# EAGLE design PoppingElement (EAGLE 6.5.0)
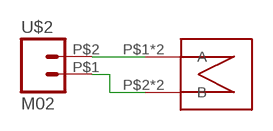
[diagram p0: schematic, sheet 1]

## Parts
U$1  CIGARETTE_LIGHTER  [CIGARETTE_LIGHTER]
U$2  M02  [PADS_2MMX2]

## Nets
N$1: U$1.P$1(A) U$1.P$3(A) U$2.P$2
N$2: U$1.P$2(B) U$1.P$4(B) U$2.P$1

## Library data of the parts
U$1 = blinkinlabs:CIGARETTE_LIGHTER
U$2 = blinkinlabs:M02

## Board
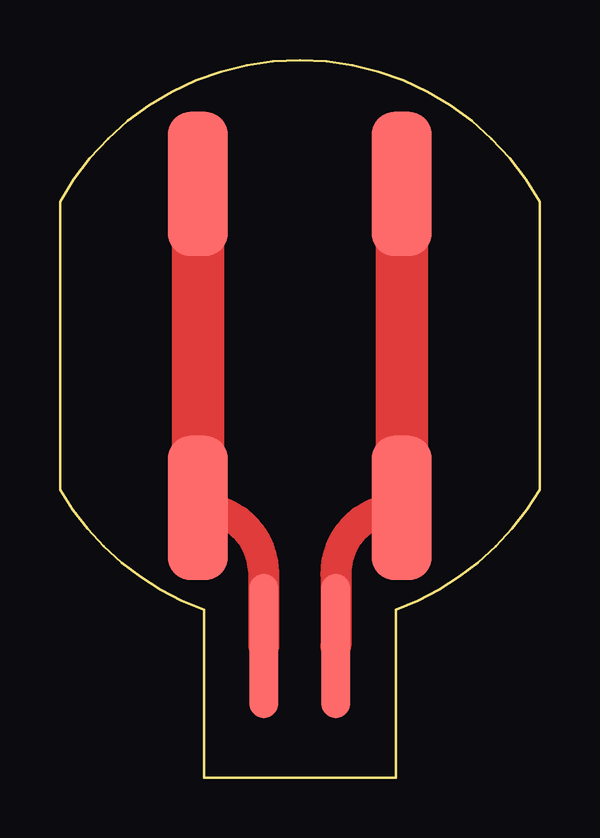
[diagram p1: board, top side]
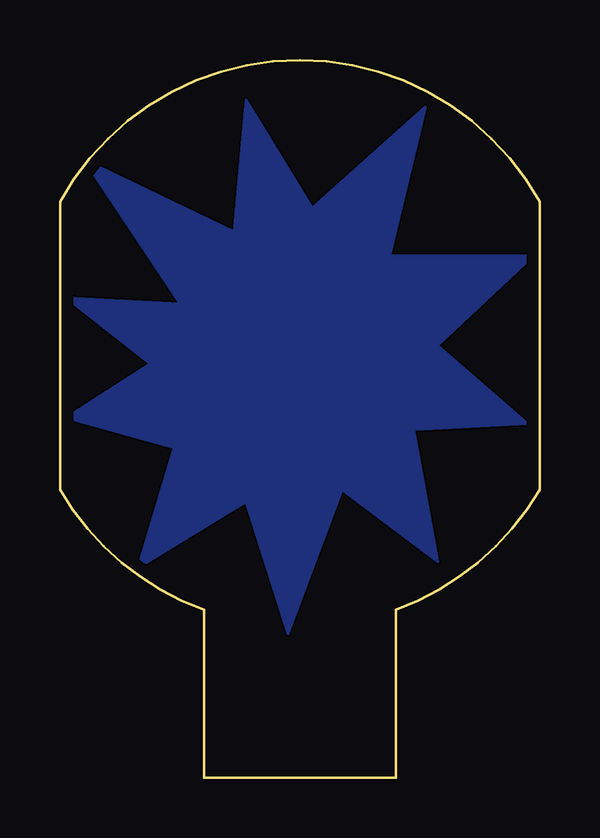
[diagram p2: board, bottom side, seen from below]

Size 20 x 29.91 mm. Coordinates in mm from the lower left corner, seen from the top.
Outline: 6,0 14,0 14,7 arc40 20,12 20,24 arc122 0,24 0,12 arc40 6,7 6,0
Copper layers (1*16): Top 0.035mm / dielectric 1.5mm / Bottom 0.035mm
Design rules "default *": minimum track width 10mil, minimum drill 24mil, track to track 8mil, track to pad 8mil, pad to pad 8mil, via to via 8mil, smd to smd 8mil, copper to edge 0.5mm, drill to drill 8mil, minimum pad ring 10mil, minimum via ring 8mil, stop-mask expansion 4mil, vias tented up to drill 0mil, thermal gap 10mil

### Footprints (pad centres in the part's own frame; a part is rotated, then mirrored left to right if it is on the bottom)
CIGARETTE_LIGHTER = smd 2.5 x 6: P$1 -4.25,6.75; P$2 4.25,6.75; P$3 -4.25,-6.75; P$4 4.25,-6.75
PADS_2MMX2 = smd 1.2 x 6: P$1 1.5,0; P$2 -1.5,0

### Placement (x,y rotation side)
U$1  10,18 0 top
U$2  10,5.5 0 top

### Tracks (layer width: path | path; a pad name or v marks a point on that pad's centre or on a via)
N$1
  Top 1.3: U$2.P$2 8.5,8.5 arc90 U$1.P$3
  Top 2.184: U$1.P$1 U$1.P$3
N$2
  Top 1.3: U$1.P$4 arc90 11.5,8.5 U$2.P$1
  Top 2.184: U$1.P$2 U$1.P$4
N$4
  pour Bottom: 12.25,11.5 10.5,6 8.25,12 4.25,9 5.25,14.5 0.5,14.75 4.25,18 0.25,21.75 6.25,21.75 4.75,28 9.5,23.75 12.25,28.25 12.75,22.75 19,25.75 15,19.75 19.75,20 16.25,17.25 19.75,15 15.25,13.75 16.75,8.75